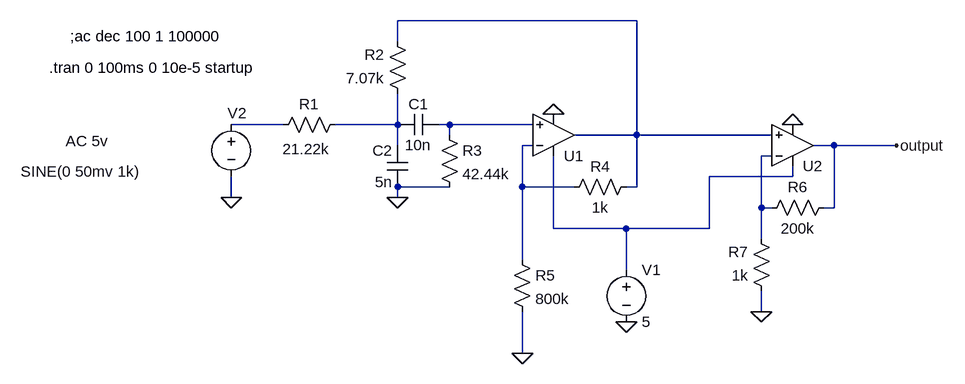
[diagram p0: schematic Draft2.asc]
Draft2.asc, the LTspice schematic file:
Version 4
SHEET 1 1040 680
WIRE 544 96 176 96
WIRE 176 128 176 96
WIRE 0 256 -80 256
WIRE 176 256 176 208
WIRE 176 256 80 256
WIRE 256 256 240 256
WIRE 384 256 256 256
WIRE 256 272 256 256
WIRE 544 272 544 96
WIRE 544 272 448 272
WIRE 752 272 544 272
WIRE 176 288 176 256
WIRE 384 288 368 288
WIRE 848 288 816 288
WIRE 944 288 848 288
WIRE 752 304 736 304
WIRE 784 336 784 320
WIRE 784 336 656 336
WIRE 256 352 176 352
WIRE 368 352 368 288
WIRE 448 352 368 352
WIRE 544 352 544 272
WIRE 544 352 528 352
WIRE -80 368 -80 336
WIRE 176 368 176 352
WIRE 736 384 736 304
WIRE 752 384 736 384
WIRE 848 384 848 288
WIRE 848 384 832 384
WIRE 416 416 416 304
WIRE 528 416 416 416
WIRE 656 416 656 336
WIRE 656 416 528 416
WIRE 736 432 736 384
WIRE 368 464 368 352
WIRE 528 480 528 416
WIRE 736 544 736 512
WIRE 368 608 368 544
FLAG 176 368 0
FLAG 368 608 0
FLAG 416 240 0
FLAG 528 560 0
FLAG -80 368 0
FLAG 736 544 0
FLAG 784 256 0
FLAG 944 288 output
SYMBOL res 96 240 R90
WINDOW 0 0 56 VBottom 2
WINDOW 3 38 61 VTop 2
SYMATTR InstName R1
SYMATTR Value 21.22k
SYMBOL res 192 224 R180
WINDOW 0 36 76 Left 2
WINDOW 3 36 40 Left 2
SYMATTR InstName R2
SYMATTR Value 7.07k
SYMBOL res 352 448 R0
SYMATTR InstName R5
SYMATTR Value 800k
SYMBOL res 544 336 R90
WINDOW 0 0 56 VBottom 2
WINDOW 3 32 56 VTop 2
SYMATTR InstName R4
SYMATTR Value 1k
SYMBOL cap 192 352 R180
WINDOW 0 24 56 Left 2
WINDOW 3 24 8 Left 2
SYMATTR InstName C2
SYMATTR Value 5n
SYMBOL OpAmps\\UniversalOpAmp2 416 272 M180
SYMATTR InstName U1
SYMBOL res 240 256 R0
SYMATTR InstName R3
SYMATTR Value 42.44k
SYMBOL cap 240 240 R90
WINDOW 0 0 32 VBottom 2
WINDOW 3 32 32 VTop 2
SYMATTR InstName C1
SYMATTR Value 10n
SYMBOL voltage 528 464 R0
WINDOW 123 0 0 Left 0
WINDOW 39 0 0 Left 0
SYMATTR InstName V1
SYMATTR Value 5
SYMBOL voltage -80 240 R0
WINDOW 0 -6 -2 Left 2
WINDOW 3 -324 88 Left 2
WINDOW 123 -255 41 Left 2
WINDOW 39 0 0 Left 0
SYMATTR InstName V2
SYMATTR Value SINE(0 50mv 1k)
SYMATTR Value2 AC 5v
SYMBOL OpAmps\\UniversalOpAmp2 784 288 M180
SYMATTR InstName U2
SYMBOL res 848 368 R90
WINDOW 0 0 56 VBottom 2
WINDOW 3 32 56 VTop 2
SYMATTR InstName R6
SYMATTR Value 200k
SYMBOL res 752 528 R180
WINDOW 0 36 76 Left 2
WINDOW 3 36 40 Left 2
SYMATTR InstName R7
SYMATTR Value 1k
TEXT -328 120 Left 2 !;ac dec 100 1 100000
TEXT -360 168 Left 2 !.tran 0 100ms 0 10e-5 startup

The netlist it stands for:
* Draft2.asc
R1 N003 N002 21.22k
R2 N003 N001 7.07k
R5 N005 0 800k
R4 N001 N005 1k
C2 0 N003 5n
XU1 N004 N005 N007 0 N001 level2 Avol=1Meg GBW=10Meg Slew=10Meg Ilimit=25m Rail=0 Vos=0 En=0 Enk=0 In=0 Ink=0 Rin=500Meg  ; pins In+ In- V+ V- OUT
R3 N004 0 42.44k
C1 N004 N003 10n
V1 N007 0 5
V2 N002 0 SINE(0 50mv 1k) AC 5v
XU2 N001 N006 N007 0 output level2 Avol=1Meg GBW=10Meg Slew=10Meg Ilimit=25m Rail=0 Vos=0 En=0 Enk=0 In=0 Ink=0 Rin=500Meg  ; pins In+ In- V+ V- OUT
R6 output N006 200k
R7 0 N006 1k
;ac dec 100 1 100000
.tran 0 100ms 0 10e-5 startup
.lib UniversalOpAmp2.lib
.backanno
.end